# EAGLE board flight_computer_board_2018_04_14 (EAGLE 8.6.0)
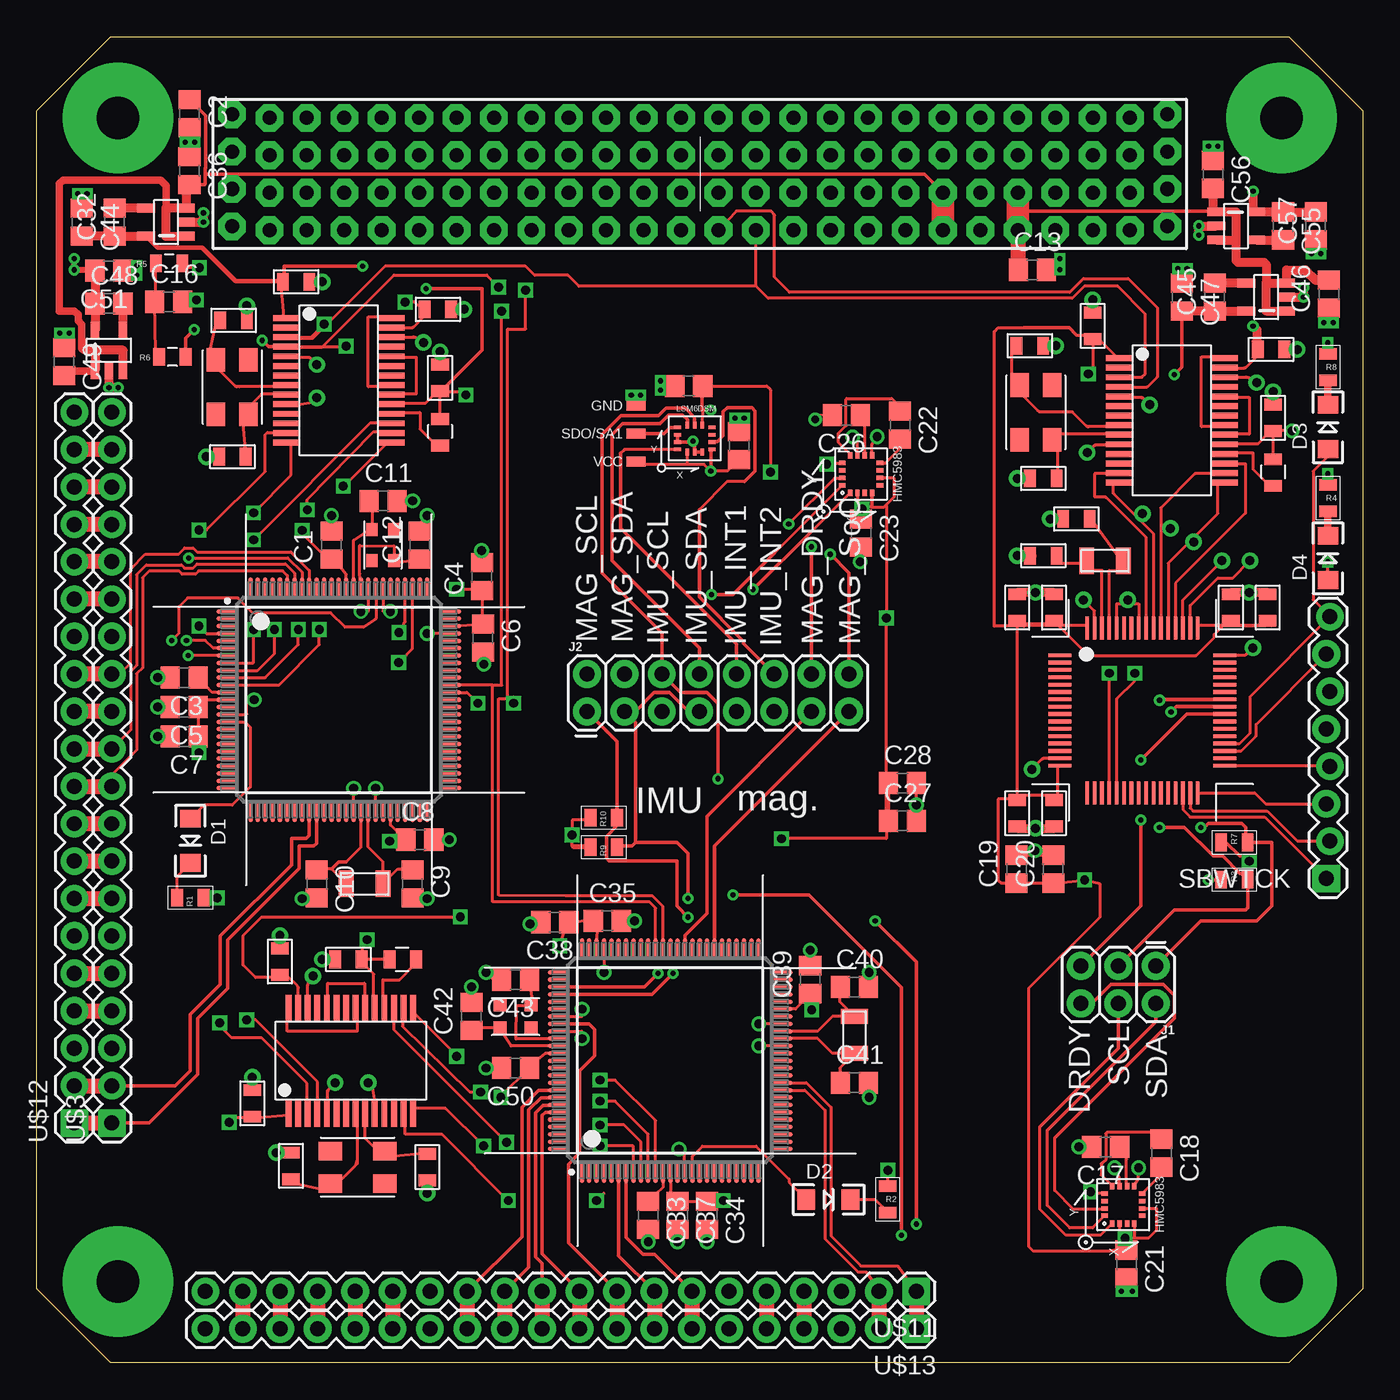
[diagram p5: board, top side]
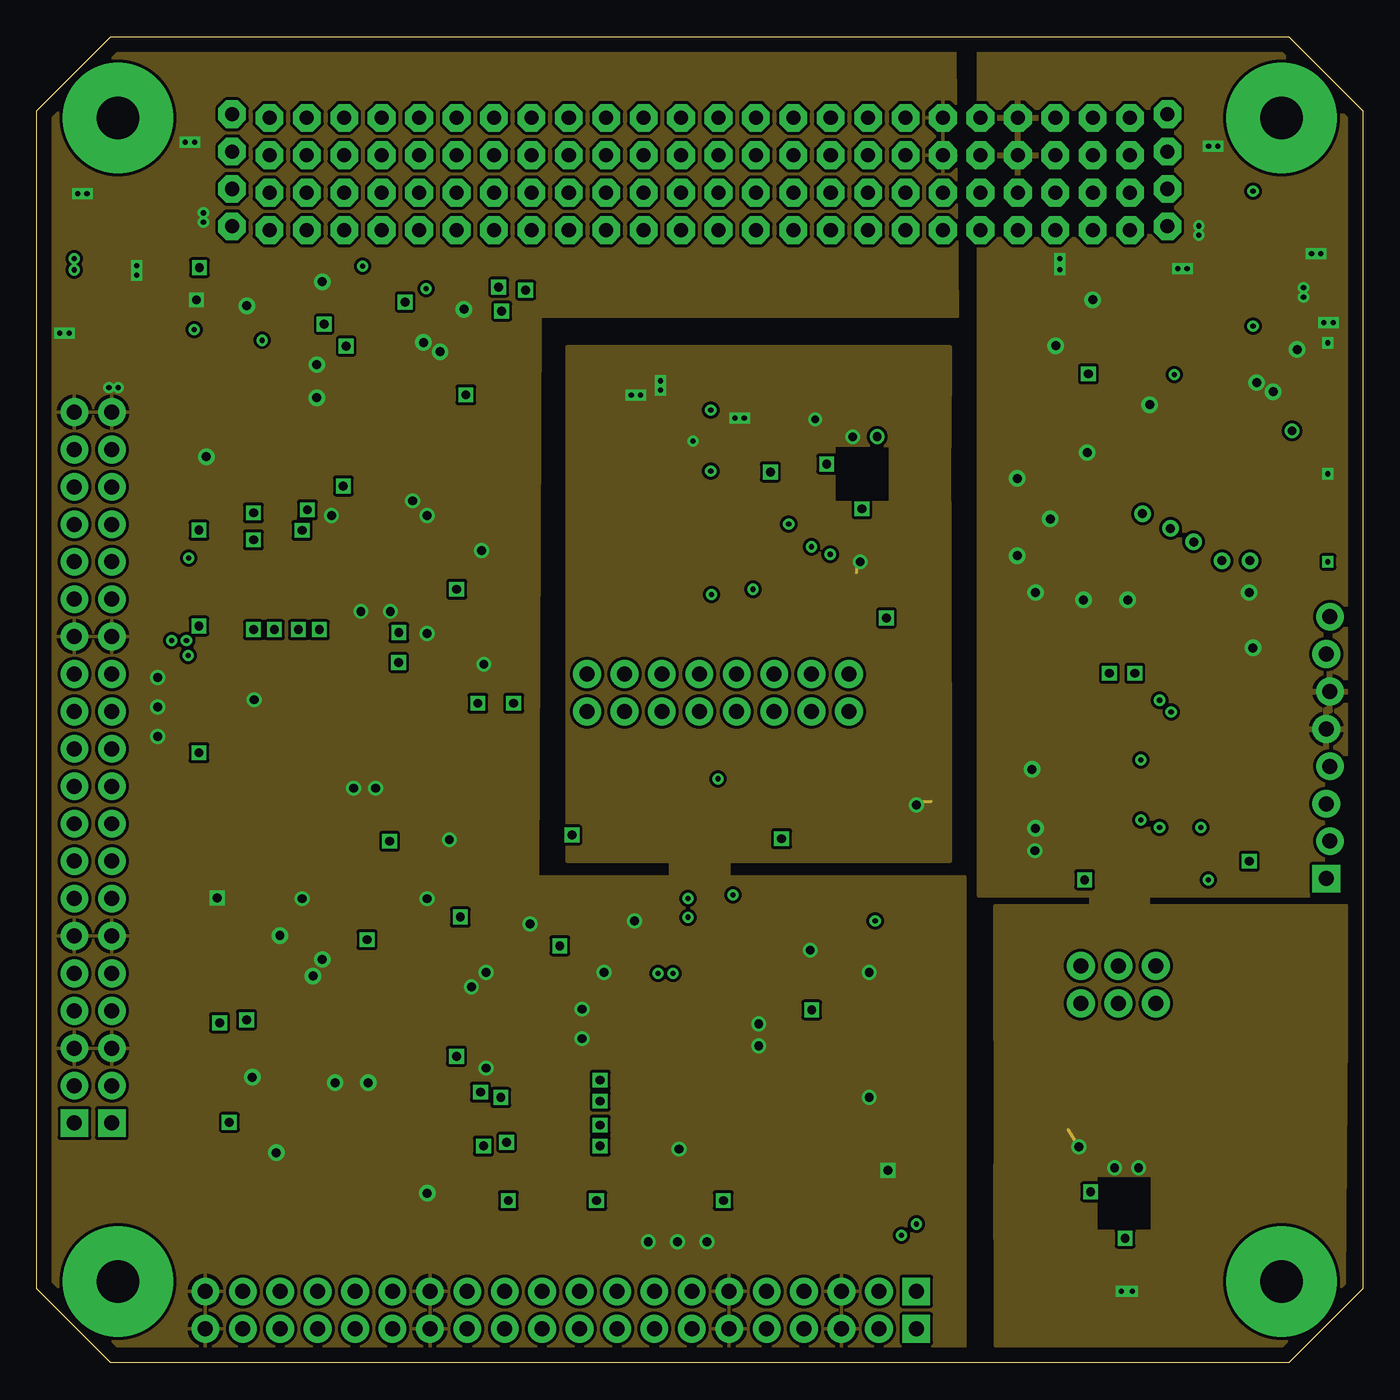
[diagram p6: board, inner layer GND]
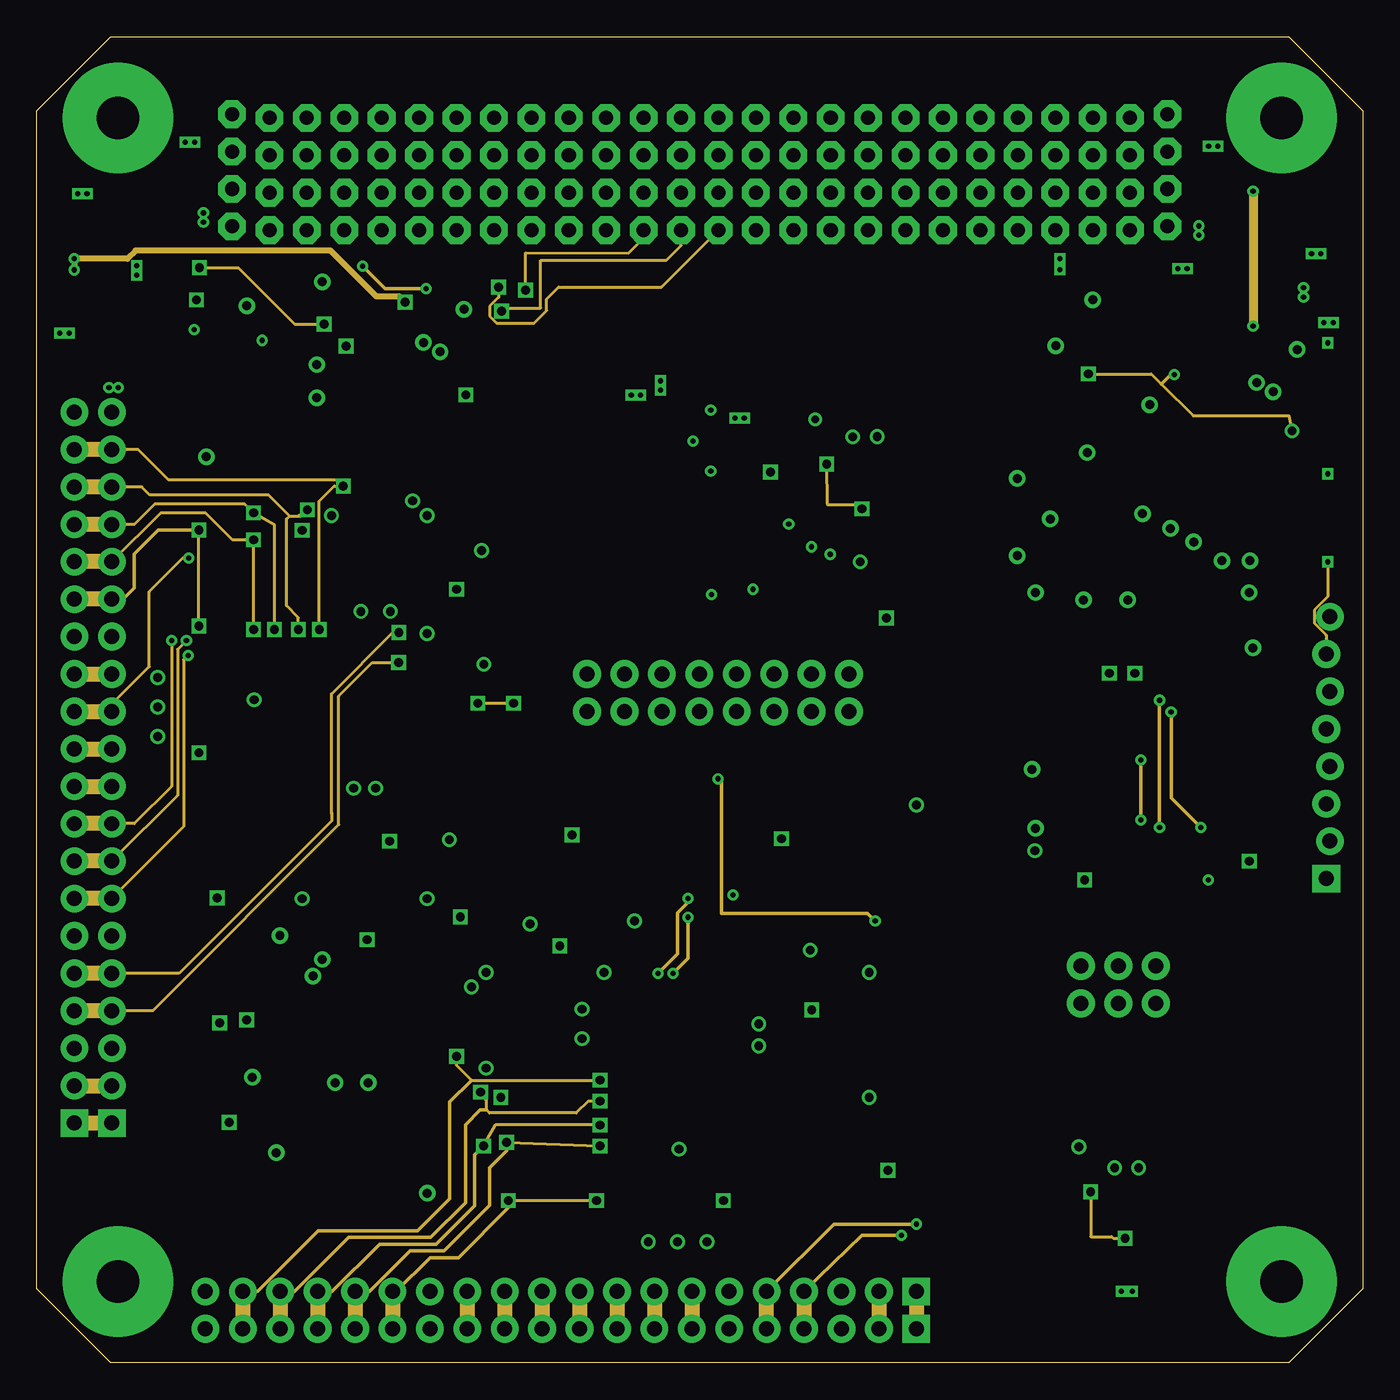
[diagram p7: board, inner layer Route3]
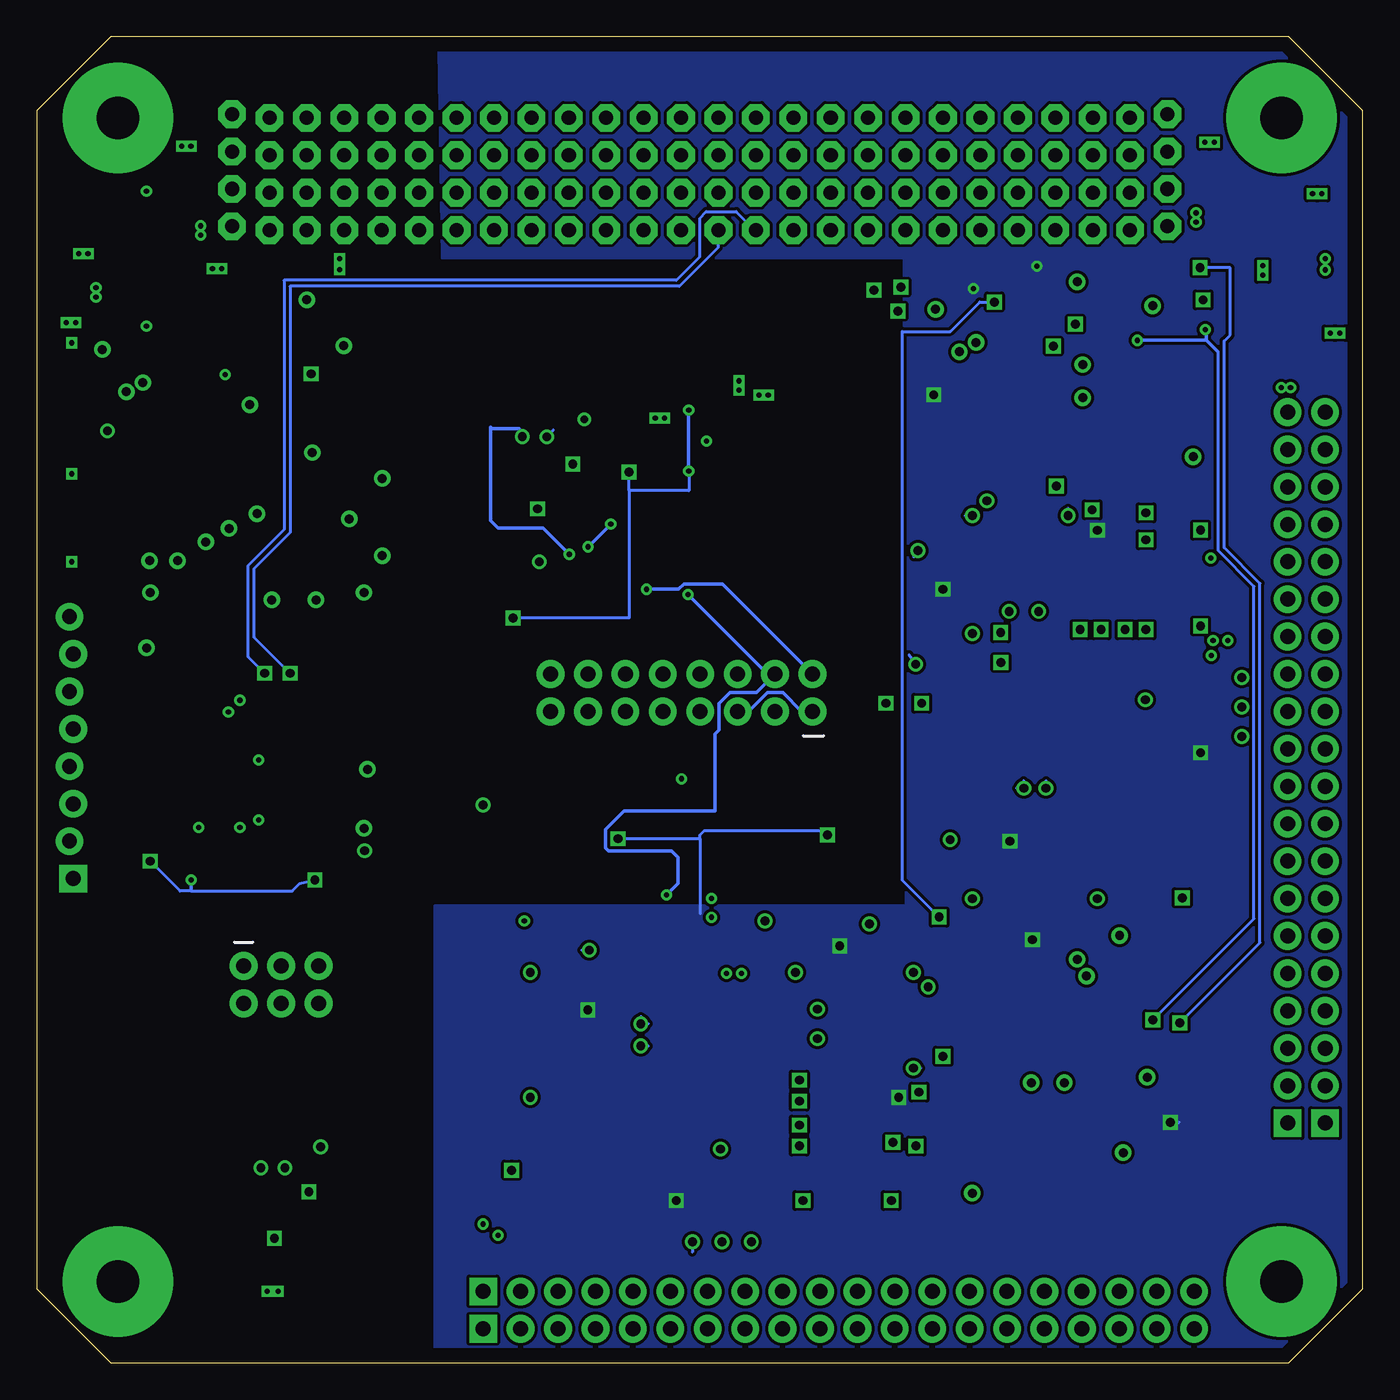
[diagram p8: board, bottom side, seen from below]

Size 90 x 90 mm. Coordinates in mm from the lower left corner, seen from the top.
Copper layers (1*2*3*16): Top 0.035mm / dielectric 1.5mm / GND 0.035mm / dielectric 0.15mm / Route3 0.035mm / dielectric 0.2mm / Bottom 0.035mm
Design rules "default *": minimum track width 10mil, minimum drill 24mil, track to track 8mil, track to pad 8mil, pad to pad 8mil, via to via 8mil, smd to smd 0mil, copper to edge 40mil, drill to drill 8mil, minimum pad ring 10mil, minimum via ring 8mil, stop-mask expansion 4mil, vias tented up to drill 0mil, thermal gap 10mil
Net classes: 0 default: width 0.254 mm, drill 0.254 mm, clearance 0.152 mm

## Footprints (pad centres in the part's own frame; a part is rotated, then mirrored left to right if it is on the bottom)
C0805 = smd 1.3 x 1.5: 1 -0.95,0; 2 0.95,0
LED-1206 = smd 1.2 x 1.4: A -1.5,0; C 1.5,0
2X3 = drill 1.016 pad 1.88: 1 0,0; 2 0,2.54; 3 2.54,0; 4 2.54,2.54; 5 5.08,0; 6 5.08,2.54
2X8 = drill 1.016 pad 1.88: 1 0,0; 2 0,2.54; 3 2.54,0; 4 2.54,2.54; 5 5.08,0; 6 5.08,2.54; 7 7.62,0; 8 7.62,2.54; 9 10.16,0; 10 10.16,2.54; 11 12.7,0; 12 12.7,2.54; 13 15.24,0; 14 15.24,2.54; 15 17.78,0; 16 17.78,2.54
0805 = smd 0.8 x 1.2: 1 -0.9,0; 2 0.9,0
0_OHM_JUMPER = smd 1.3 x 0.7: P$1 0,-1.9; P$2 0,0; P$3 0,1.9
PZ0100A_N = smd 1.45 x 0.3: 1 -7.575,6; 2 -7.575,5.5; 3 -7.575,5; 4 -7.575,4.5; 5 -7.575,4; 6 -7.575,3.5; 7 -7.575,3; 8 -7.575,2.5; 9 -7.575,2; 10 -7.575,1.5; 11 -7.575,1; 12 -7.575,0.5; 13 -7.575,0; 14 -7.575,-0.5; 15 -7.575,-1; 16 -7.575,-1.5; 17 -7.575,-2; 18 -7.575,-2.5; 19 -7.575,-3; 20 -7.575,-3.5; 21 -7.575,-4; 22 -7.575,-4.5; 23 -7.575,-5; 24 -7.575,-5.5; 25 -7.575,-6; 51 7.575,-6; 52 7.575,-5.5; 53 7.575,-5; 54 7.575,-4.5; 55 7.575,-4; 56 7.575,-3.5; 57 7.575,-3; 58 7.575,-2.5; 59 7.575,-2; 60 7.575,-1.5; 61 7.575,-1; 62 7.575,-0.5; 63 7.575,0; 64 7.575,0.5; 65 7.575,1; 66 7.575,1.5; 67 7.575,2; 68 7.575,2.5; 69 7.575,3; 70 7.575,3.5; 71 7.575,4; 72 7.575,4.5; 73 7.575,5; 74 7.575,5.5; 75 7.575,6 | smd 0.3 x 1.45: 26 -6,-7.575; 27 -5.5,-7.575; 28 -5,-7.575; 29 -4.5,-7.575; 30 -4,-7.575; 31 -3.5,-7.575; 32 -3,-7.575; 33 -2.5,-7.575; 34 -2,-7.575; 35 -1.5,-7.575; 36 -1,-7.575; 37 -0.5,-7.575; 38 0,-7.575; 39 0.5,-7.575; 40 1,-7.575; 41 1.5,-7.575; 42 2,-7.575; 43 2.5,-7.575; 44 3,-7.575; 45 3.5,-7.575; 46 4,-7.575; 47 4.5,-7.575; 48 5,-7.575; 49 5.5,-7.575; 50 6,-7.575; 76 6,7.575; 77 5.5,7.575; 78 5,7.575; 79 4.5,7.575; 80 4,7.575; 81 3.5,7.575; 82 3,7.575; 83 2.5,7.575; 84 2,7.575; 85 1.5,7.575; 86 1,7.575; 87 0.5,7.575; 88 0,7.575; 89 -0.5,7.575; 90 -1,7.575; 91 -1.5,7.575; 92 -2,7.575; 93 -2.5,7.575; 94 -3,7.575; 95 -3.5,7.575; 96 -4,7.575; 97 -4.5,7.575; 98 -5,7.575; 99 -5.5,7.575; 100 -6,7.575
SOT-23-5 = smd 0.6 x 1.2: P$1 -0.95,-1.35; P$2 0,-1.35; P$3 0.95,-1.35; P$4 0.95,1.35; P$5 -0.95,1.35
FC-135R = smd 1 x 1.8: P$1 -1.25,0; P$2 1.25,0
FA-238 = smd 0.9 x 0.8: P$1 -1.05,-0.75; P$2 1.05,-0.75; P$3 1.05,0.75; P$4 -1.05,0.75
1X20 = drill 1.016 pad 1.88 square: 1 0,0 | drill 1.016 pad 1.88: 2 2.54,0; 3 5.08,0; 4 7.62,0; 5 10.16,0; 6 12.7,0; 7 15.24,0; 8 17.78,0; 9 20.32,0; 10 22.86,0; 11 25.4,0; 12 27.94,0; 13 30.48,0; 14 33.02,0; 15 35.56,0; 16 38.1,0; 17 40.64,0; 18 43.18,0; 19 45.72,0; 20 48.26,0
BOARD_TEMPLATE = drill 2.9 pad 7.5: P$1 -39.5,39.5; P$2 -39.5,-39.5; P$3 39.5,-39.5; P$4 39.5,39.5
PC104_CONNECTOR = drill 0.953 pad 1.88 octagon: P$1 -31.75,32.134; P$2 -31.75,34.674; P$3 -31.75,37.214; P$4 -31.75,39.754; P$5 -29.21,31.88; P$6 -29.21,34.42; P$7 -29.21,36.96; P$8 -29.21,39.5; P$9 -26.67,31.88; P$10 -26.67,34.42; P$11 -26.67,36.96; P$12 -26.67,39.5; P$13 -24.13,31.88; P$14 -24.13,34.42; P$15 -24.13,36.96; P$16 -24.13,39.5; P$17 -21.59,31.88; P$18 -21.59,34.42; P$19 -21.59,36.96; P$20 -21.59,39.5; P$21 -19.05,31.88; P$22 -19.05,34.42; P$23 -19.05,36.96; P$24 -19.05,39.5; P$25 -16.51,31.88; P$26 -16.51,34.42; P$27 -16.51,36.96; P$28 -16.51,39.5; P$29 -13.97,31.88; P$30 -13.97,34.42; P$31 -13.97,36.96; P$32 -13.97,39.5; P$33 -11.43,31.88; P$34 -11.43,34.42; P$35 -11.43,36.96; P$36 -11.43,39.5; P$37 -8.89,31.88; P$38 -8.89,34.42; P$39 -8.89,36.96; P$40 -8.89,39.5; P$41 -6.35,31.88; P$42 -6.35,34.42; P$43 -6.35,36.96; P$44 -6.35,39.5; P$45 -3.81,31.88; P$46 -3.81,34.42; P$47 -3.81,36.96; P$48 -3.81,39.5; P$49 -1.27,31.88; P$50 -1.27,34.42; P$51 -1.27,36.96; P$52 -1.27,39.5; P$53 1.27,31.88; P$54 1.27,34.42; P$55 1.27,36.96; P$56 1.27,39.5; P$57 3.81,31.88; P$58 3.81,34.42; P$59 3.81,36.96; P$60 3.81,39.5; P$61 6.35,31.88; P$62 6.35,34.42; P$63 6.35,36.96; P$64 6.35,39.5; P$65 8.89,31.88; P$66 8.89,34.42; P$67 8.89,36.96; P$68 8.89,39.5; P$69 11.43,31.88; P$70 11.43,34.42; P$71 11.43,36.96; P$72 11.43,39.5; P$73 13.97,31.88; P$74 13.97,34.42; P$75 13.97,36.96; P$76 13.97,39.5; P$77 16.51,31.88; P$78 16.51,34.42; P$79 16.51,36.96; P$80 16.51,39.5; P$81 19.05,31.88; P$82 19.05,34.42; P$83 19.05,36.96; P$84 19.05,39.5; P$85 21.59,31.88; P$86 21.59,34.42; P$87 21.59,36.96; P$88 21.59,39.5; P$89 24.13,31.88; P$90 24.13,34.42; P$91 24.13,36.96; P$92 24.13,39.5; P$93 26.67,31.88; P$94 26.67,34.42; P$95 26.67,36.96; P$96 26.67,39.5; P$97 29.21,31.88; P$98 29.21,34.42; P$99 29.21,36.96; P$100 29.21,39.5; P$101 31.75,32.134; P$102 31.75,34.674; P$103 31.75,37.214; P$104 31.75,39.754
MSP-CAN_BLOCK = smd 1.2 x 0.8: 1 -6,6.08; 2 -6,7.88; 3 -8.5,6.08; 4 -8.5,7.88; 9 -8.5,-6.08; 10 -8.5,-7.88; 11 -6,-6.08; 12 -6,-7.88; 13 8.5,6.08; 14 8.5,7.88; 15 6,6.08; 16 6,7.88; 23 8.875,18.955; 24 8.875,20.755; 25 8.875,17.045; 26 8.875,15.245; 27 -3.375,25.205; 28 -3.375,27.005 | smd 1 x 0.25: 3.3V@CAN1 -3.375,25.125; 3.3V@CAN2 8.875,18.875; 3.3V@MSP1 8.501,5.884; 3.3V@MSP2 -8.533,-5.962; 3.3V_ANALOG@MSP2 -8.482,5.904 | smd 0.8 x 1.2: 5 -5.83,10.5; 6 -7.63,10.5; 7 -3.58,13; 8 -5.38,13; 17 -8.545,24.75; 18 -6.745,24.75; 19 -5.83,15.75; 20 -7.63,15.75; 21 7.83,24.5; 22 9.63,24.5 | smd 0.25 x 1: 5V 7.65,24.5 | smd 1.75 x 0.4: CANH -1.6,21.96; CANL -1.6,22.61; P$65 -1.6,23.91; P$66 -1.6,23.26; P$69 -1.6,21.31; P$70 -1.6,20.66; P$71 -1.6,20.01; P$72 -1.6,19.36; P$73 -1.6,18.71; P$74 -1.6,18.06; P$75 -1.6,17.41; P$76 -1.6,16.76; P$77 -1.6,16.11; P$78 -1.6,15.46; P$79 5.6,15.46; P$80 5.6,16.11; P$81 5.6,16.76; P$82 5.6,17.41; P$83 5.6,18.06; P$84 5.6,18.71; P$85 5.6,19.36; P$86 5.6,20.01; P$87 5.6,20.66; P$88 5.6,21.31; P$89 5.6,21.96; P$90 5.6,22.61; P$91 5.6,23.26; P$92 5.6,23.91 | drill 0.61: GND@1 -3.375,27.875; GND@2 -5.875,24.75; GND@3 -3.75,17.5; GND@4 0.5,20.75; GND@5 -8.5,15.75; GND@7 -8.5,10.5; GND@8 -7.25,8; GND@9 -4,7.5; GND@10 -1,7.5; GND@11 7.75,22.25; GND@12 10.5,24.5; GND@13 8.875,21.625; GND@14 7.25,8; GND@15 7.5,4.25; GND@16 -7.5,-4; GND@17 -7.25,-8; GND@26 -6.25,13; P2.4_SPI-CS2 5.397,10.16; P2.7_SPI-CS3 7.303,10.16; P5.4_SPI-MOSI 3.487,11.434; P5.5_SPI-MISO 1.9,12.354; P5.6_SPI-CLK 0,13.348 | smd 1.55 x 0.25: P1.0_A0 -5.6,3.75; P1.1_A1 -5.6,3.25; P1.2_A2 -5.6,2.75; P1.3_A3 -5.6,-1.75; P1.4_A4 -5.6,-2.25; P1.5_A5 -5.6,-2.75; P1.6_GPIO/PWM 5.6,-0.75; P1.7_GPIO/PWM 5.6,-0.25; P2.1_RXD 5.6,-3.75; P2.2_GPIO/PWM 5.6,-3.25; P3.0_A12 -5.6,2.25; P3.1_A13 -5.6,1.75; P3.2_A14 -5.6,1.25; P3.3_A15 -5.6,0.75; P3.4_GPIO_DEBUG 5.6,-2.75; P3.5_GPIO_DEBUG 5.6,-2.25; P3.6_GPIO/PWM 5.6,-1.75; P3.7_GPIO/PWM 5.6,-1.25; P5.0_I2C-SDA-1 5.6,0.25; P5.1_I2C-SCL-1 5.6,0.75; P7.0_I2C-SDA-2 -5.6,-0.25; P7.1_I2C-SCL-2 -5.6,-0.75; P$8 -5.6,0.25; P$11 -5.6,-1.25; P$15 -5.6,-3.25; P$16 -5.6,-3.75; P$43 5.6,1.25; P$44 5.6,1.75; P$45 5.6,2.25; P$46 5.6,2.75; P$47 5.6,3.25; P$48 5.6,3.75 | smd 0.25 x 1.55: P2.0_TXD 3.75,-5.6; P2.5_GPIO 1.75,-5.6; P2.6_GPIO/PWM 2.25,-5.6; P4.0_GPIO -0.25,-5.6; P4.1_GPIO 0.25,-5.6; P4.2_GPIO 0.75,-5.6; P4.3_GPIO 1.25,-5.6; P7.2_SYNC1 -1.75,-5.6; P7.3_GPIO -1.25,-5.6; P7.4_GPIO -0.75,-5.6; P$17 -3.75,-5.6; P$18 -3.25,-5.6; P$19 -2.75,-5.6; P$49 3.75,5.6; P$50 3.25,5.6; P$51 2.75,5.6; P$52 2.25,5.6; P$53 1.75,5.6; P$54 1.25,5.6; P$55 0.75,5.6; P$56 0.25,5.6; P$57 -0.25,5.6; P$58 -0.75,5.6; P$59 -1.25,5.6; P$60 -1.75,5.6; P$61 -2.25,5.6; P$62 -2.75,5.6; P$63 -3.25,5.6; P$64 -3.75,5.6; PJ.3_SYNC2 -2.25,-5.6; SBWTCK 2.75,-5.6; SBWTDIO 3.25,-5.6 | smd 1 x 1.8: P$93 -3.79,10.16; P$94 -1.29,10.16 | smd 1.25 x 1.6: P$104 -6.13,18.38; P$105 -6.13,22.08; P$106 -8.33,22.08; P$107 -8.33,18.38
CAN_BLOCK = smd 0.25 x 1: 3.3V@CAN1 -3.875,6.375; 5V 5.65,4.5 | smd 1 x 0.25: 3.3V@CAN2 6.875,-1.125; CLK -3.25,-4.6; CS 3.4,-3.2; INT -3.25,-3.85; MISO 3.25,-4.6; MOSI 3.25,-3.85 | smd 0.8 x 1.2: 17 -8.045,3.75; 18 -6.245,3.75; 19 -6.33,-5.5; 20 -8.13,-5.5; 21 5.83,4.5; 22 7.63,4.5; 27 -3.795,6.375; 28 -1.995,6.375 | smd 1.2 x 0.8: 23 6.875,-1.045; 24 6.875,0.755; 25 6.875,-2.955; 26 6.875,-4.755 | smd 1.75 x 0.4: CANH -3.6,1.96; CANL -3.6,2.61; P$65 -3.6,3.91; P$66 -3.6,3.26; P$69 -3.6,1.31; P$70 -3.6,0.66; P$71 -3.6,0.01; P$72 -3.6,-0.64; P$73 -3.6,-1.29; P$74 -3.6,-1.94; P$75 -3.6,-2.59; P$76 -3.6,-3.24; P$77 -3.6,-3.89; P$78 -3.6,-4.54; P$79 3.6,-4.54; P$80 3.6,-3.89; P$81 3.6,-3.24; P$82 3.6,-2.59; P$83 3.6,-1.94; P$84 3.6,-1.29; P$85 3.6,-0.64; P$86 3.6,0.01; P$87 3.6,0.66; P$88 3.6,1.31; P$89 3.6,1.96; P$90 3.6,2.61; P$91 3.6,3.26; P$92 3.6,3.91 | drill 0.61: GND@1 -1.125,6.375; GND@2 -6.25,4.75; GND@3 -1.5,-1.5; GND@4 -1.5,0.75; GND@5 -9,-5.5; GND@11 5.75,2.25; GND@12 8.5,4.5; GND@13 6.875,1.625 | smd 1.25 x 1.6: P$104 -6.13,-2.62; P$105 -6.13,1.08; P$106 -8.33,1.08; P$107 -8.33,-2.62
1X08_CONNECTOR = drill 1.016 pad 1.88: 2 2.54,-0.127; 3 5.08,0.127; 4 7.62,-0.127; 5 10.16,0.127; 6 12.7,-0.127; 7 15.24,0.127; 8 17.78,-0.127 | drill 1.016 pad 1.88 square: SBWTCK 0,0.127
HMC5983 = smd 0.45 x 0.3: !SPI_CS -1.275,-0.75; C1 1.275,-0.25; GND 1.275,0.25; NC@3 -1.275,-0.25; SCL/SPI_SCK -1.275,0.75; SETC 1.275,0.75; SOC 1.275,-0.75; VDD -1.275,0.25 | smd 0.3 x 0.45: DRDY -0.25,1.275; I2C/!SPI -0.25,-1.275; NC@1 0.25,1.275; NC@2 0.25,-1.275; SDA/SPI_SDI -0.75,1.275; SETP 0.75,-1.275; SPI_SDO -0.75,-1.275; VDDIO 0.75,1.275
LSM6DSM = smd 0.25 x 0.475: CS 0.5,0.912; GND@1 0,-0.912; GND@2 0.5,-0.912; SCL 0,0.912; SDA -0.5,0.912; VDDIO -0.5,-0.912 | smd 0.475 x 0.25: INT1 -1.163,-0.75; INT2 1.163,-0.25; OCS_AUX 1.163,0.25; SCX -1.163,-0.25; SDO/SA0 -1.163,0.75; SDO_AUX 1.163,0.75; SDX -1.163,0.25; VDD 1.163,-0.75

## Placement (x,y rotation side)
C1  0.1uF  [C0805]  20,55.5 90 top
C2  10 uF  [C0805]  10.37,84.77 270 top
C3  0.1 uF  [C0805]  10,46.5 180 top
C4  4.7 uF  [C0805]  30.21,53.35 90 top
C5  0.1 uF  [C0805]  10,44.5 180 top
C6  0.1 uF  [C0805]  30.29,49.18 270 top
C7  4.7 uF  [C0805]  10,42.5 180 top
C8  0.1 uF  [C0805]  26,35.5 0 top
C9  13 pF  [C0805]  25.5,32.5 270 top
C10  13 pF  [C0805]  19,32.5 270 top
C11  13 pF  [C0805]  23.5,58.5 0 top
C12  13 pF  [C0805]  26,55.5 90 top
C13  10 uF  [C0805]  67.57,74.18 0 top
C16  4.7 nF  [C0805]  8.96,72.01 0 top
C17  4.7 uF  [C0805]  72.55,14.64 180 top
C18  0.22 uF  [C0805]  76.34,14.23 270 top
C19  0.1 uF  [C0805]  66.5,33.5 90 top
C20  0.1 uF  [C0805]  69,33.5 90 top
C21  0.1 uF  [C0805]  73.97,6.7 270 top
C22  0.22 uF  [C0805]  58.59,63.65 270 top
C23  0.1 uF  [C0805]  55.95,56.32 270 top
C24  0.1 uF  [C0805]  44.25,66.3 180 top
C25  0.1 uF  [C0805]  47.67,62.26 270 top
C26  4.7 uF  [C0805]  54.95,64.32 180 top
C27  0.1 uF  [C0805]  58.76,36.78 0 top
C28  0.1 uF  [C0805]  58.76,39.35 0 top
C32  0.01 μF  [C0805]  5.28,77.42 90 top
C33  0.1 uF  [C0805]  41.5,10 270 top
C34  4.7 uF  [C0805]  45.5,10 270 top
C35  0.1 uF  [C0805]  38.72,29.99 0 top
C36  1 μF  [C0805]  10.36,80.91 270 top
C37  0.1 uF  [C0805]  43.5,10 270 top
C38  4.7 uF  [C0805]  35.16,29.9 180 top
C39  0.1 uF  [C0805]  52.5,26 90 top
C40  13 pF  [C0805]  55.5,25.5 0 top
C41  13 pF  [C0805]  55.5,19 0 top
C42  13 pF  [C0805]  29.5,23.5 90 top
C43  13 pF  [C0805]  32.5,26 180 top
C44  4.7 μF  [C0805]  3.06,77.42 270 top
C45  0.01 μF  [C0805]  79.96,72.34 90 top
C46  1 μF  [C0805]  87.7,72.53 90 top
C47  4.7 μF  [C0805]  77.73,72.34 270 top
C48  0.01 μF  [C0805]  4.9,71.89 0 top
C49  1 μF  [C0805]  1.85,67.95 270 top
C50  0.1 uF  [C0805]  32.5,20 180 top
C51  4.7 μF  [C0805]  4.9,74.11 180 top
C55  0.01 μF  [C0805]  84.59,77.16 270 top
C56  1 μF  [C0805]  79.83,80.66 270 top
C57  4.7 μF  [C0805]  86.81,77.16 90 top
D1  [LED-1206]  10.42,35.42 270 top
D2  [LED-1206]  53.73,11.07 0 top
D3  [LED-1206]  87.64,63.51 90 top
D4  [LED-1206]  87.64,54.62 90 top
J1  FEMALE 2x3  [2X3]  75.96,26.93 180 top
J2  [2X8]  37.35,44.21 0 top
R1  330 ohm  [0805]  10.42,31.56 0 top
R2  330 ohm  [0805]  57.76,11.09 90 top
R3  10 kohm  [0805]  81.29,32.78 180 top
R4  [0805]  87.64,58.68 90 top
R5  60  [0805]  8.98,74.63 180 top
R6  60  [0805]  9.2,68.28 180 top
R7  10 kohm  [0805]  81.29,35.32 180 top
R8  [0805]  87.64,67.57 90 top
R9  10 kohm  [0805]  38.49,34.98 0 top
R10  10 kohm  [0805]  38.49,36.98 0 top
SDO/SA1  0_OHM_JUMPER  [0_OHM_JUMPER]  40.67,63.06 180 top
U1  Value  [PZ0100A_N]  20.5,45 0 top
U2  Value  [PZ0100A_N]  43,20.5 90 top
U4  TPS732XX  [SOT-23-5]  8.77,77.42 90 top
U5  TPS732XX  [SOT-23-5]  83.45,72.34 90 top
U6  TPS732XX  [SOT-23-5]  4.9,68.72 0 top
U8  TPS732XX  [SOT-23-5]  81.42,77.16 270 top
U$1  EPSON_CRYSTAL_FC-135R  [FC-135R]  22.25,32.5 180 top
U$2  EPSON_CRYSTAL_FA-238  [FA-238]  23.5,55.5 270 top
U$3  M20  [1X20]  5.09,16.27 90 top
U$4  EPSON_CRYSTAL_FC-135R  [FC-135R]  55.5,22.25 270 top
U$5  BOARD_TEMPLATE1  [BOARD_TEMPLATE]  45,45 0 top
U$6  PC104_CONNECTOR  [PC104_CONNECTOR]  45,45 0 top
U$7  MSP-CAN_BLOCK  [MSP-CAN_BLOCK]  75.05,44.28 0 top
U$8  CAN_BLOCK  [CAN_BLOCK]  20.5,67 0 top
U$9  EPSON_CRYSTAL_FA-238  [FA-238]  32.5,23.5 0 top
U$10  CAN_BLOCK  [CAN_BLOCK]  21,20.5 90 top
U$11  M20  [1X20]  59.7,4.84 180 top
U$12  M20  [1X20]  2.55,16.27 90 top
U$13  M20  [1X20]  59.7,2.3 180 top
U$14  PROGRAM/DEBUG_PORT  [1X08_CONNECTOR]  87.66,32.86 90 top
U$15  HMC5983  [HMC5983]  73.75,10.72 90 top
U$17  LSM6DSM  [LSM6DSM]  44.66,62.74 0 top
U$18  HMC5983  [HMC5983]  55.95,60.32 90 top

## Tracks (layer width: path | path; a pad name or v marks a point on that pad's centre or on a via)
BCLUART_RXD1  (via drill 0.35)
  Top 0.203: U1.6 11.97,48.5 11.44,49.03 10.17,49.03 v10.16,49.02
  Top 1.016: U$12.8 U$3.8
  Route3 0.203: v10.16,49.02 9.56,48.42 9.56,38.52 U$3.8
  Route3 1.016: U$3.8 U$12.8
BCLUART_RXD2
  Top 0.254: U2.6 39.5,7.26 U$11.8
  Top 1.016: U$11.8 U$13.8
  Route3 1.016: U$11.8 U$13.8
BCLUART_TXD1  (via drill 0.35)
  Top 0.203: U1.7 v10.27,48
  Top 1.016: U$12.7 U$3.7
  Route3 0.203: v10.27,48 9.97,47.7 9.97,36.38 U$3.7
  Route3 1.016: U$3.7 U$12.7
BCLUART_TXD2
  Top 0.254: U$11.7 41.93,7.37 41.16,7.37 40,8.52 U2.7
  Top 0.406: U$13.7 44.82,2.06
  Top 1.016: U$11.7 U$13.7
  Route3 1.016: U$11.7 U$13.7
BDOT_3V3  (via drill 0.35, 0.6)
  Top 0.203: 70.57,69.76 71.32,69.76 U$7.3.3V@CAN1 71.67,67.41 v71.38,67.12 | v85.2,63.26 84.03,63.26 U$7.3.3V@CAN2 | U$7.3.3V@MSP1 83.44,50.05 80.53,50.05 79.92,49.44 79.92,49.23 78.7,48.02 71.38,48.02 69.22,50.18 U$7.3.3V_ANALOG@MSP2 66.57,38.37 U$7.3.3V@MSP2 66.45,38.25 65.25,38.25 65.25,32.75 65.45,32.55 C19.1 C20.1 | 67,50 65,50 65,70 65.25,70.25 67,70.25 | U$15.VDD 73.57,9.38 73.47,9.27 73.47,8.95 73.87,8.54 v73.87,8.44 | v71.54,11.59 71.94,11.49 72.45,11.49 U$15.VDDIO | v73.87,8.44 73.97,8.14 C21.1 72.87,7.6 | 73.76,7.72 72.87,7.6 | U$15.I2C/!SPI 76,10.47 76,8.97 75.47,8.44 74.5,8.44 | 74.5,8.44 v73.87,8.44 | U$15.!SPI_CS 74.5,8.44 | 72.87,7.6 67.61,7.6 67.32,7.88 67.32,25.41 72.15,30.24 72.15,32.52 v71.13,32.78 69.08,32.52 69.03,32.52 C20.1 | 69.15,32.75 C20.1
  Top 0.254: v82.31,34.05 81.97,34.39 81.65,34.39 80.72,35.32 R7.2 | C47.2 77.73,67.57 v77.23,67.07 | 67,70.25 70.08,70.25 70.57,69.76 | U$7.3.3V_ANALOG@MSP2 66.82,50.18 67,50 | R3.2 v79.51,32.78
  Top 0.61: U5.P$5 C45.1 C47.2
  Route3 0.203: v71.38,67.12 75.65,67.12 76.34,66.43 78.5,64.27 85,64.27 v85.2,63.26 | v71.54,11.59 71.54,8.54 72.96,8.54 73.06,8.44 v73.87,8.44
  Route3 0.254: v77.23,67.07 76.97,67.07 76.34,66.43
  Bottom 0.203: v82.31,34.05 80.27,32.01 79.51,32.01 72.65,32.01 72.15,32.52 v71.13,32.78
  Bottom 0.254: v79.51,32.78 79.51,32.01
BDOT_5V  (via drill 0.35)
  Top 0.254: 82.81,69.35 82.81,68.89 U$7.5V
  Top 0.61: C57.2 C55.1 U8.P$5 82.56,78.32 v82.56,79.51 | v82.56,70.37 82.81,70.11 82.81,69.35
  Route3 0.61: v82.56,79.51 v82.56,70.37
BDOT_DRDY
  Top 0.203: U$15.DRDY arc-90 72.42,10.42 70.37,10.42 69.1,11.69 69.1,15.25
  Top 0.254: J1.6 71.62,24.39 72.89,25.66 76.48,25.66 77.23,24.92 77.23,23.38 69.1,15.25
BDOT_DRDY_JP  (via drill 0.35)
  Top 0.254: J1.5 74.94,31 v74.94,36.84 | v74.94,40.9 78.06,44.03 U$7.P1.7_GPIO/PWM
  Route3 0.254: v74.94,36.84 v74.94,40.9
BDOT_GND  (via drill 0.35, 0.6)
  Top 0.203: C19.2 C20.2 69,34.5 v67.75,34.75 | U$15.GND 73.47,12.03 73.47,12.61 73.16,12.91 v73.16,13.22 | U$15.SOC 74.79,12.49 v74.79,13.22 | C17.2 v70.72,14.64 | C13.2 68.55,74.2 v69.45,74.2 v69.45,74.94
  Top 0.254: v74.36,4.84 74.36,5.36 74.02,5.7 | 74.02,5.7 C21.2 | v73.62,4.84 74.02,5.24 74.02,5.7
  Top 0.305: v78.08,74.27 77.95,73.5 77.89,73.45 | 77.89,73.45 C47.1 | v77.44,74.27 77.89,73.69 77.89,73.45 | v87.36,70.59 87.48,71.36 C46.1 88.12,71.16 v87.99,70.59
  Top 0.508: R4.2 v87.64,60.34 | R8.2 v87.64,69.22
  Top 0.61: U5.P$2 v85.99,72.34 v85.99,72.97 | U8.P$2 v78.88,77.16 v78.88,76.53 | v86.53,75.28 86.81,75.57 C57.1 86.81,75.63 v87.16,75.28 | v79.54,82.59 79.54,81.9 C56.1 79.83,82.24 v80.17,82.59
  GND 0.203: 68,34.75 v67.75,34.75 | v74.79,13.22 74.89,13.62 | v73.16,13.22 73.36,13.22 | v70.72,14.64 70.01,15.81
  pour GND: 64,90 90,90 90,31.75 64,31.75
  pour GND (rank 2): 65.03,1.16 88.75,1.16 89,31 75.5,31 75.5,34 71.5,34 71.5,31 65,31 65.03,12.71 75.7,12.71 75.7,8.9 65.03,8.9
  pour GND (no thermals): 65.03,13.47 71.89,13.47 71.89,8.39 65.03,8.39
BDOT_LDO_3V3_BYP
  Top 0.61: U5.P$4 C45.2
BDOT_LDO_5V_BYP
  Top 0.61: U8.P$4 C55.2
BDOT_P3.4_GPIO_DEBUG  (via drill 0.35)
  Top 0.203: U$7.P3.4_GPIO_DEBUG 81.76,41.53 82.74,42.5 | 82.74,42.5 82.76,42.53 | 82.74,42.5 82.74,42.54 82.76,42.56 82.76,43.34 U$14.7 | D4.A v87.64,54.37
  Route3 0.203: v87.64,54.37 87.64,52.01 86.72,51.08 86.72,50.2 87.53,49.39 U$14.7
BDOT_P3.5_GPIO_DEBUG
  Top 0.203: U$7.P3.5_GPIO_DEBUG 81.65,42.03 82.36,42.73 82.36,45.22 U$14.8 86.63,51.79 86.63,60.52 87.64,61.52 D3.A
BDOT_RXD
  Top 0.203: U$14.4 87.74,40.53 U$7.P2.1_RXD
BDOT_SCL
  Top 0.203: 72.96,9.41 U$15.SCL/SPI_SCK 72.19,8.65 69.86,8.65 68.08,10.42 68.08,16.01
  Top 0.254: 68.08,16.01 73.42,21.35 J1.4
BDOT_SCL_JP  (via drill 0.35)
  Top 0.254: J1.3 77.23,30.74 82.05,30.74 82.17,30.86 82.19,30.86 R3.1 81.75,33.21 81.67,33.21 80.49,34.39 79.85,34.39 77.91,36.33 v76.21,36.33 | v76.21,44.97 76.27,45.03 U$7.P5.1_I2C-SCL-1
  Route3 0.254: v76.21,36.33 v76.21,44.97
BDOT_SDA
  Top 0.203: 71.72,9.22 U$15.SDA/SPI_SDI 71.65,9.15 70.11,9.15 68.59,10.68 68.59,15.76
  Top 0.254: 68.59,15.76 75.96,23.12 J1.2
BDOT_SDA_JP  (via drill 0.35)
  Top 0.254: J1.1 79,29.98 82.81,29.98 83.83,31 83.83,35.32 R7.1 82.05,35.45 82.05,36.33 81.8,36.59 79.51,36.59 79.26,36.33 v79,36.33 | v77,44.18 77.35,44.53 U$7.P5.0_I2C-SDA-1
  Route3 0.254: v79,36.33 77,38.34 v77,44.18
BDOT_TXD
  Top 0.203: U$7.P2.0_TXD 82.68,38.68 83.41,37.94 U$14.3
BDOT_VBAT
  Top 0.254: U5.P$3 | C46.2 87.94,73.72 | U8.P$1 80.03,78.15 67.16,78.15 67.07,78.24 66.59,78.24 | U$6.P$86 67.33,79.42
  Top 0.508: U5.P$1 | 79.83,80.02 C56.2
  Top 0.61: 83.45,73.29 U5.P$3 | 83.45,73.29 83.45,71.38 U5.P$1 | U8.P$1 81.42,78.11 81.42,76.21 | 81.42,76.21 81.41,76.21 U8.P$3 | U8.P$1 79.83,78.35 79.83,80.02 | U5.P$3 84.85,73.33 84.85,74.18 86.12,74.18 86.82,73.48 C46.2 | 83.45,73.29 83.45,74.56 83.32,74.69 81.54,74.69 81.42,74.81 81.42,76.21
  Top 1.016: C13.1 66.62,76.85 U$6.P$85
  Top 1.524: U$6.P$86 66.59,78.24 U$6.P$85
CAN-INT1  (via drill 0.6)
  Top 0.203: v11,50 11.5,49.5 U1.4 | v11,56.51 11.51,56.51 15.5,60.5 15.5,63 15.65,63.15 U$8.INT
  Top 1.016: U$3.15 U$12.15
  Route3 0.203: v11,50 v11,56.51
  Route3 0.254: v11,56.51 8.25,56.51 6.61,54.87 6.61,52.59 5.85,51.83 U$3.15
  Route3 1.016: U$3.15 U$12.15
CAN-INT2  (via drill 0.6)
  Top 0.203: 38.5,11.5 v38,11 | v32,11 27.5,15.5 25,15.5 25,17.1 U$10.INT
  Top 1.016: U$11.15 U$13.15
  Route3 0.203: v38,11 v32,11 32,10.5
  Route3 0.254: 32,10.5 28.62,7.12 26.68,7.12 24.39,4.84 U$11.15
  Route3 1.016: U$11.15 U$13.15
CANH  (via drill 0.35, 0.6)
  Top 0.203: U$7.CANH 75.38,66.24 76.06,66.91 76.06,71.63 74.09,73.59 71.05,73.59 70.11,72.65 51.09,72.65 50.07,73.67 50.07,77.89 49.84,78.17 47.48,78.17 U$6.P$53 | U$10.CANH 19.06,16.92 19.06,19.06 14.84,23.28 v14.23,23.28 | v31.35,73.01 30.54,73.82 24.24,73.82 19.36,68.95 16.91,68.95 U$8.CANH 20.96,68.96 v21,69
  Top 0.254: U$8.CANH 15.74,68.96 v15.3,69.4 | v10.68,70.11 10.1,69.54 R6.1
  Route3 0.203: U$6.P$53 42.4,73.01 35.42,73.01 34.61,72.2 34.61,71.42 33.76,70.58 31.22,70.58 30.75,71.05 30.75,71.72 31.35,72.32 v31.35,73.01
  Bottom 0.203: v14.23,23.28 7.38,30.13 7.38,52.69 9.81,55.13 9.81,68.59 9.84,68.61
  Bottom 0.254: 10.62,69.4 v15.3,69.4 | 9.84,68.61 10.62,69.4 | 10.62,69.4 10.62,70.06 v10.68,70.11
CANL  (via drill 0.6)
  Top 0.203: U$7.CANL 75.02,66.89 75.25,67.12 75.25,71.18 73.36,73.06 71.09,73.06 70.28,72.25 49.63,72.25 48.82,73.06 | 48.82,73.06 U$6.P$57 | U$10.CANL 18.35,16.94 18.35,18.96 15.25,22.06 13.22,22.06 12.41,22.87 v12.41,23.07 | v19.5,70.5 18.61,69.61 U$8.CANL 16.95,69.56 18.75,69.56 23.63,74.43 33.18,74.43 33.8,73.82 36.05,73.82 36.8,73.06 48.82,73.06 | v11.03,74.33 10.18,74.33 R5.1
  Route3 0.203: v19.5,70.5 17.5,70.5 13.67,74.33 v11.03,74.33
  Bottom 0.203: v12.41,23.07 6.97,28.51 6.97,52.89 9.41,55.33 9.41,69.35 9,69.76 9,74.33 v11.03,74.33
ESTIMAT_3V3  (via drill 0.35, 0.6)
  Top 0.203: U1.13 11.4,45 C5.1 C7.1 11,42.4 v11,41.4 | U1.87 21,53.5 20.6,54 C1.1 19.69,54.6 17.94,56.35 | U1.73 C6.1 C4.1 29.6,52.5 v28.5,52.5 | C8.1 24.86,35.64 24,36.5 U1.45 | U2.13 43,11.4 C37.1 C34.1 45.6,11 v46.6,11 | U2.87 34.5,21 34,20.6 C50.1 31.5,18.1 v31.5,18 | U2.73 38.06,29.42 37.79,29.69 C35.1 C38.1 35.91,29.58 v35.5,28.3 | 52.46,25 C39.1 | 52.46,25 52.36,24.86 51.5,24 U2.45 | U$8.3.3V@CAN2 28.94,65.88 v29.12,65.69 | 16.56,73.38 U$8.3.3V@CAN1 | U$10.3.3V@CAN2 22.12,28.42 v22.41,28.71 | U$10.3.3V@CAN1 13.37,16.62 v13.07,16.32 | 57.67,36.63 v57.67,50.56 57.67,58.18 57.63,58.21 | R10.1 37.45,36.84 36.33,36.84 v36.33,35.82 36.33,35.06 | 36.33,35.06 36.41,34.98 R9.1 37.51,35.06 36.33,35.06 | v50.56,35.57 57.67,35.57 57.67,36.63 | 47.53,61.16 46.89,60.52 v45.75,60.52 45.3,60.97 44.13,60.97 | U$17.CS 45.17,63.74 45.22,64.65 | v49.79,60.46 49.79,66.05 49.54,66.3 C24.1 | C23.1 55.95,57.32 | 55.95,57.32 55.95,57.73 | 55.95,57.73 55.7,57.98 v56.01,57.96 | v56.01,57.96 55.73,58.63 U$18.VDD | U$18.I2C/!SPI 58.16,60.07 58.19,60.04 58.19,58.77 57.63,58.21 | 57.63,58.21 57.5,58.09 56.65,58.09 56.31,58.09 55.95,57.73 | v53.62,61.01 54.21,61.07 U$18.VDDIO | v56.01,57.96 55.7,57.57 55.95,57.32 | C28.1 C27.1 57.67,36.63 | U$17.VDDIO 44.13,61.8 44.13,60.97 | v52.6,23.95 52.46,24.09 52.46,25 | 40.65,60.97 40.67,60.99 SDO/SA1.P$3 40.86,60.97 44.13,60.97
  Top 0.254: v45.75,60.52 45.75,61.91 U$17.VDD | C25.2 47.53,61.16 | v45.75,64.65 45.22,64.65 45.16,64.65 45.16,66.26 C24.1 | U$18.!SPI_CS 56.7,58.14 56.65,58.09 | U$8.3.3V@CAN2 30.24,68.74 30.24,72.91 v26.43,72.91 | U$8.3.3V@CAN1 16.77,73.52 16.77,74.43 v22.11,74.43 | v18,56.5 17.94,56.44 17.94,56.35 | C8.1 24.95,35.4 v23.95,35.4
  Top 0.305: U4.P$5 8.19,75.7 11.22,75.7 13.51,73.42 16.58,73.42 U$8.3.3V@CAN1
  Top 0.61: U4.P$5 C32.1 C44.2
  Route3 0.203: v53.62,61.01 53.64,58.29 53.69,58.24 55.65,58.26 v56.01,57.96
  Route3 0.254: v22.11,74.43 23.63,72.91 v26.43,72.91
  Bottom 0.203: v29.12,65.69 29.12,65.49 28.91,65.29 | v22.41,28.71 22.62,28.71 22.82,28.91 | v13.07,16.32 12.46,16.32 | v36.33,35.82 36.59,36.08 44.71,36.08 44.97,35.82 44.97,35.57 | 44.97,35.57 44.97,30.49 | v50.56,35.57 44.97,35.57 | 49.79,59.19 49.79,50.56 v57.67,50.56 | 45.73,60.46 45.73,59.19 49.79,59.19 | 49.79,59.19 v49.79,60.46
  Bottom 0.254: v45.75,60.52 v45.75,64.65
  pour Bottom: -0.24,91.23 62.75,91.19 62.5,75 31.16,75 31,31 63,31 63,-0.5 -2.25,-0.75
ESTIMAT_5V  (via drill 0.35, 0.6)
  Top 0.203: v25,72 25.65,72 U$8.5V | U$10.5V 14.85,26.15 14,27 14,29 15.25,30.25 v28.75,30.25
  Top 0.406: C51.2 3.89,74.18 v2.55,74.18 v2.55,74.94
  Top 0.61: U6.P$5 C48.1 C51.2
  Route3 0.406: v25,72 24.62,72.38 23.06,72.38 19.94,75.49 6.7,75.49 6.15,74.94 v2.55,74.94 v2.55,74.18
  Bottom 0.203: v25,72 26,72 28,70 31.25,70 31.25,32.75 v28.75,30.25
ESTIMAT_DRDY  (via drill 0.35)
  Top 0.203: U$18.DRDY 54.64,60.03 54.14,60.03 v51.04,56.93
  Top 0.254: J2.14 v52.59,55.38
  Bottom 0.254: v52.59,55.38 v51.04,56.93
ESTIMAT_DRDY_JP
  Top 0.254: J2.13 45.48,37.09 45.48,30.49 44,29.01 U2.61
ESTIMAT_GND  (via drill 0.35, 0.51, 0.6)
  Top 0.152: C26.2 52.89,64.32 52.84,64.27 v52.84,64.02
  Top 0.203: C11.2 v25.5,58.5 | C9.2 v26.5,31.5 | C10.2 v18,31.5 | C3.2 v8.2,46.5 | C5.2 v8.2,44.5 | C7.2 v8.2,42.5 | U1.15 14.25,44 14.25,45 v14.75,45 | C1.2 v20,57.5 | U1.82 23.5,51 | 23.5,51 | 23.5,51 v24,51 | U1.84 22.5,51 v22,51 | U1.72 v26.5,49.5 | C6.2 v30.34,47.41 | C4.2 v30.2,55.13 | U1.40 v21.5,39 | U1.43 v23,39 | C8.2 27.76,35.44 v28,35.5 | C12.2 26,57 v26.5,57.5 | C42.2 v29.5,25.5 | C40.2 v56.5,26.5 | C41.2 v56.5,18 | C33.2 v41.5,8.2 | C37.2 v43.5,8.2 | C34.2 v45.5,8.2 | U2.15 43.95,14.08 43.59,14.44 v43.59,14.5 | C50.2 v30.5,20 | U2.82 37,23.5 | 37,23.5 | 37,23.5 v37,24 | U2.84 37,22.5 v37,22 | U2.72 v38.5,26.5 | C35.2 v40.56,30 | C38.2 v33.48,29.79 | U2.40 v49,21.5 | U2.43 v49,23 | C39.2 52.56,27.76 v52.5,28 | C43.2 31,26 v30.5,26.5 | R1.2 v12.25,31.56 | R2.2 57.76,12.86 v57.77,13.07 | C16.2 10,72.15 v10.83,72.15 | U$18.GND 55.7,62.57 v55.38,62.84 | C23.2 55.89,55.35 v55.89,54.37 | C27.2 59.7,36.74 59.7,36.33 59.66,36.37 C27.2 | C27.2 C28.2 | C27.2 59.7,36.81 v59.7,37.86
  Top 0.254: U$17.SDX U$17.SCX 44.5,62.5 | 44.5,62.5 44.66,62.34 U$17.GND@1 U$17.GND@2 | 44.5,62.5 v44.55,62.55 | v42.34,66.01 43.01,66.01 C24.2 42.95,66.65 v42.34,66.65 | v47.38,64.12 47.38,63.5 47.57,63.3 | 47.57,63.3 C25.1 | v48.02,64.12 48.02,63.75 47.57,63.3 | v40.36,65.67 40.67,65.33 40.67,65.3 | v40.99,65.67 40.67,65.3 | 40.67,65.3 SDO/SA1.P$1
  Top 0.305: v3.4,79.35 3.28,78.59 3.22,78.53 | 3.22,78.53 C44.1 | v2.77,79.35 3.22,78.77 3.22,78.53 | v10.71,82.84 10.58,82.08 C36.1 9.94,82.28 v10.07,82.84
  Top 0.508: v10.07,82.84 10.37,83.14 C2.2 10.37,83.17 v10.71,82.84
  Top 0.61: U4.P$2 v11.31,77.42 v11.31,78.05 | U6.P$2 v4.9,66.18 v5.53,66.18 | v6.78,73.83 6.49,74.11 C51.1 6.43,74.11 v6.78,74.46 | v1.56,69.89 1.56,69.19 C49.1 1.85,69.54 v2.2,69.89
  GND 0.203: v10.83,72.15 11.24,71.74 | v55.89,54.37 55.64,54.11 55.64,53.6 | v59.7,37.86 59.95,38.11 60.72,38.11
  Bottom 0.203: v8.2,42.5 7.91,42.5 | v14.75,45 14.89,44.75 | v20,57.5 20,58 | v24,51 24.09,51 | v22,51 21.7,51 | v26.5,49.5 26.41,49.5 | v30.34,47.41 30.79,48.05 | v30.2,55.13 30.5,54.72 | v21.5,39 21.5,39.5 | v23,39 23,39.5 23.5,39 | v28,35.5 28.25,35.5 | v26.5,57.5 27,57.5 | v45.5,8.2 45.5,7.5 | v43.59,14.5 43.75,14.49 | v30.5,20 30,20 | v37,24 37,24.09 | v37,22 37,21.7 | v38.5,26.5 38.5,26.41 | v40.56,30 40.77,30.18 | v33.48,29.79 33.16,29.75 | v49,21.5 48.5,21.5 | v49,23 48.5,23 49,23.5 | v52.5,28 53,28 | v30.5,26.5 30.7,26.19 | v12.25,31.56 12.66,31.56 | v57.77,13.07 57.77,13.47 | v55.38,62.84 54.95,63.32
  Bottom 0.254: v44.55,62.55 44.5,62.5
  pour GND: -0.71,92.66 62.3,92.56 62.5,71 34.16,71 34,33 63,33 63,-0.5 -2.25,-0.75
  pour GND: 43,33 43,34 36,34 36,69 62,69 61.99,62.14 54.11,62.24 54.11,58.43 61.99,58.43 62,34 47,34 47,33
  pour GND (no thermals): 61.99,58.18 61.99,62.24 57.92,62.24 57.92,58.18
ESTIMAT_LDO_3V3_BYP
  Top 0.61: U4.P$4 C32.2
ESTIMAT_LDO_5V_BYP
  Top 0.61: U6.P$4 C48.2
ESTIMAT_SCL_IMU  (via drill 0.35)
  Top 0.254: U$17.SCL 44.66,64.16 44.03,64.79 42.7,64.79 42.19,64.28 39.65,64.28 38.36,63 38.36,53.6 42.43,49.54 J2.6 43.7,45.48 45.49,45.48 46.24,44.73 v46.24,39.63 | v59.7,9.41 59.7,27.19 v56.91,29.98
  Top 1.016: U$11.5 U$13.5
  Route3 0.254: U$11.5 54.11,9.41 v59.7,9.41 | v56.91,29.98 56.4,30.49 46.49,30.49 46.49,39.38 v46.24,39.63
  Route3 1.016: U$13.5 U$11.5
ESTIMAT_SCL_JP  (via drill 0.35)
  Top 0.254: J2.1 39.39,42.16 39.39,37.09 R10.2 39.39,36.45 38.66,35.72 38.66,34.25 38.86,34.05 43.44,34.05 43.44,31 v44.21,30.24 | U2.79 41.76,25 v43.19,26.43
  Route3 0.254: v43.19,26.43 44.21,27.44 v44.21,30.24
  Bottom 0.254: J2.1 38.09,44.21 39.36,45.48 40.41,45.48 41.68,44.21 J2.5
ESTIMAT_SCL_MAG  (via drill 0.35)
  Top 0.203: U$18.SCL/SPI_SCK 52.62,56.46
  Top 0.254: 52.62,56.46 48.66,52.5 v48.61,52.5
  Bottom 0.254: v48.61,52.5 46.44,52.5 46.09,52.85 43.45,52.85 J2.2
ESTIMAT_SDA_IMU
  Top 0.254: U$17.SDA 44.16,64.02 43.84,64.34 42.89,64.34 42.3,63.75 39.76,63.75 39.03,63.01 39.03,54.46 44.97,48.52 J2.8
ESTIMAT_SDA_JP  (via drill 0.35)
  Top 0.254: J2.7 44.22,44.21 42.95,45.48 41.9,45.48 40.63,44.21 J2.3 40.65,43.44 40.65,35.32 | R9.2 39.47,35.06 40.4,35.06 40.65,35.32 | U2.78 41.25,25.5 v42.17,26.43 | v44.21,31.51 44.21,34.55 43.44,35.32 40.65,35.32
  Route3 0.254: v44.21,31.51 44.21,31.24 43.5,30.53 43.5,27.75 v42.17,26.43
ESTIMAT_SDA_MAG  (via drill 0.35)
  Top 0.203: U$18.SDA/SPI_SDI 50.08,54.97
  Top 0.254: 50.08,54.97 47.25,52.14 v45.79,52.14 | v58.68,8.65 58.68,9.65 58.69,9.66 58.69,25.48 52.42,31.76 v47.25,31.76
  Top 1.016: U$11.4 U$13.4
  Route3 0.254: v58.68,8.65 56.03,8.65 U$11.4
  Route3 1.016: U$11.4 U$13.4
  Bottom 0.254: v45.79,52.14 40.4,46.75 J2.4 41.16,45.48 42.95,45.48 43.7,44.73 43.7,42.94 43.95,42.68 43.95,37.45 50.15,37.45 51.39,36.21 51.39,34.93 51.2,34.74 46.93,34.74 46.49,34.3 46.49,32.52 v47.25,31.76
ESTIMAT_SOC  (via drill 0.35, 0.6)
  Top 0.203: U$18.SOC 56.7,62.34 v57.05,62.86
  Top 0.254: J2.16 55.13,53.6 v53.86,54.87
  Bottom 0.203: v57.05,62.86 57.1,63.24 57.25,63.39
  Bottom 0.254: v53.86,54.87 55.64,56.65 58.68,56.65 59.19,57.16 59.19,63.51 59.08,63.39 57.25,63.39
ESTIMAT_SOC_JP
  Top 0.254: J2.15 46,35.08 U2.57
ESTIMAT_VBAT
  Top 0.254: U4.P$3 | 10.12,79.72 C36.2 11.38,79.96 11.44,80.02 11.44,80.78 | U6.P$1 | 11.44,80.78 11.44,81.07 11.45,81.09 11.45,84.64 C2.1 | U$6.P$78 60.24,80.69 11.53,80.69 11.44,80.78
  Top 0.508: U4.P$1 | C49.2 1.85,67.32 | 1.66,67.19 C49.2 | 8.77,78.37 8.77,79.89 8.39,80.27 1.79,80.27 1.53,80.02 1.53,71.38 2.55,71.38 2.8,71.13 2.8,70.72 3.06,70.47 3.06,68.84 3.19,68.72 3.95,68.72 | U6.P$1 3.9,67.32 2.42,67.32 C49.2
  Top 0.61: U4.P$3 8.77,78.37 8.77,76.46 U4.P$1 | 10.12,79.72 U4.P$3 | U6.P$1 3.95,68.72 5.85,68.72 U6.P$3
  Top 1.524: U$6.P$78 U$6.P$77
I2C_SCL1  (via drill 0.6)
  Top 0.203: v24.57,49.56 24.77,49.96 24.66,49.96 24.7,49.69 25,50.3 U1.79
  Top 1.016: U$12.5 U$3.5
  Route3 0.203: U$3.5 9.66,26.43 20,36.76 20,37.25 20,37.35 20,45.4 24.16,49.56 v24.57,49.56
  Route3 1.016: U$3.5 U$12.5
I2C_SDA1  (via drill 0.6)
  Top 0.203: 24.65,47.61 v24.56,47.52 | 24.65,47.61 25.5,48.46 U1.78 | 24.65,47.61 24.65,47.41
  Top 1.016: U$12.4 U$3.4
  Route3 0.203: U$3.4 7.87,23.89 20.5,36.52 20.5,45.25 22.77,47.52 v24.56,47.52
  Route3 1.016: U$3.4 U$12.4
IMU_INT1
  Top 0.203: U$17.INT1 39.89,61.99 39.63,61.73
  Top 0.254: 39.63,61.73 39.63,56.65 47.51,48.78 J2.10
IMU_INT2
  Top 0.203: 48.05,59.82 46.86,59.82 44.97,57.92
  Top 0.254: U$17.INT2 45.87,62.53 46.2,62.53 46.59,62.93 46.59,64.55 46.87,64.83 48.53,64.83 48.75,64.61 48.75,60.52 48.05,59.82 | 44.97,57.92 44.97,51.97 47.97,48.97 47.97,48.83 J2.12
N$1
  Top 0.203: U2.16 44.5,14.02 45.17,14.69 48.83,14.69 51.06,12.46 51.06,12.24 D2.A
N$2
  Top 0.203: D2.C 56.89,11.07 R2.1
N$3
  Top 0.203: U1.16 14.13,43.5 14.49,43.14 14.49,39.08 13.27,37.86 11.36,37.86 D1.A
N$4
  Top 0.203: R1.1 9.52,33.02 D1.C
N$7
  Top 0.203: U1.12 11.9,45.5 C3.1
N$8
  Top 0.203: 21,34 22,35 U1.41 | U1.41 | U$1.P$2 20,33.5 19.1,33.5 C10.1
  Top 0.254: 20,33.5 20.5,34 21,34
N$9
  Top 0.203: U1.42 22.5,35 23.5,34 U$1.P$1 24.5,33.5 25.4,33.5 C9.1
N$10
  Top 0.203: U1.85 21.93,53.56 21.93,55.47 24.25,55.45 U$2.P$3 24.4,54.3 C12.1
N$11
  Top 0.203: U1.86 21.49,52.78 21.49,55.81 22.63,56.55 U$2.P$1 22.75,58.35 C11.1
N$16
  Top 0.508: D4.C R4.1
N$17
  Top 0.203: R6.2 8.06,68.55 C16.1 8.08,72.03 R5.2
N$18
  Top 0.508: D3.C R8.1
N$19
  Top 0.203: U$15.C1 73.97,12.02 73.97,13.83 73.45,14.52 C17.1
N$20
  Top 0.203: U$15.SETP 76.34,12.79 C18.2
N$21
  Top 0.203: U$15.SETC 72.25,12.74 72.25,13.52 72.25,13.47 72.36,13.59 72.38,13.59 72.55,13.76 72.55,15.55 72.65,15.66 75.8,15.66 76.54,14.92 C18.1
N$25
  Top 0.254: SDO/SA1.P$2 42.57,63.06 43,63.49 U$17.SDO/SA0
N$34
  Top 0.203: U$18.C1 56.2,64.32 C26.1
N$35
  Top 0.203: U$18.SETP 57.59,61.07 58.55,62.02 58.55,62.7 C22.2
N$36
  Top 0.203: U$18.SETC 55.2,61.68 54.43,62.45 54.43,63.09 54.94,63.6 54.94,65.4 54.99,65.45 58.04,65.45 58.72,64.77 58.72,64.73 C22.1
N$40
  Top 0.203: U2.42 53,22.5 54,23.5 U$4.P$1 54.5,24.5 54.5,25.4 C40.1
N$41
  Top 0.203: U2.41 53,22 54,21 U$4.P$2 54.5,20 54.5,19.1 C41.1 | U2.41
N$42
  Top 0.203: U2.86 35.22,21.49 32.19,21.49 31.45,22.63 U$9.P$1 29.65,22.75 C42.1
N$43
  Top 0.203: U2.85 35.09,21.98 32.53,21.98 32.55,24.25 U$9.P$3 33.7,24.4 C43.1
RST1  (via drill 0.35)
  Top 0.203: 23.02,52.59 23.02,52.76 | 23.02,52.59 23.02,50.52 22.18,49.93 20.92,49.93 19.95,50.9 14.66,50.9 13.65,51.92 10.23,51.92 9.62,51.31 9.62,49.48 9.17,49.03 v9.15,49.03 | U1.83 23.01,52.59 23.02,52.59
  Top 1.016: U$12.9 U$3.9
  Route3 0.203: v9.15,49.03 9.15,39.13 6.61,36.59 U$3.9
  Route3 1.016: U$3.9 U$12.9
RST2
  Top 0.254: U2.83 37.47,23 37.86,22.62 37.86,20.84 36.84,19.82 36.84,14.23 36.08,13.47 36.08,8.14 U$11.9
  Top 1.016: U$11.9 U$13.9
  Route3 1.016: U$11.9 U$13.9
SBWTCK
  Top 0.203: U$7.SBWTCK 77.8,37.54 78.29,37.04 83.35,37.04 U$14.SBWTCK
SBWTDIO
  Top 0.203: U$7.SBWTDIO 78.3,37.65 78.5,37.45 83.52,37.45 85.56,35.4 U$14.2
SPI-CLK1  (via drill 0.6)
  Top 0.203: v16.13,49.76 16.13,48.13 14.99,47 U1.9 | v14.71,57.69 17.25,60.26 U$8.CLK
  Top 1.016: U$3.17 U$12.17
  Route3 0.203: v16.13,49.76 16.13,56.87 v14.71,57.69 14.1,58.29 8,58.29 6.61,56.91 U$3.17
  Route3 1.016: U$3.17 U$12.17
SPI-CLK2  (via drill 0.6)
  Top 0.203: U2.9 41,14.99 39.87,16.13 v38.24,16.13 | v30.32,14.71 27.74,17.25 U$10.CLK
  Top 1.016: U$11.17 U$13.17
  Route3 0.203: v38.24,16.13 31.13,16.13 v30.32,14.71
  Route3 0.254: U$11.17 20.05,4.84 23.26,8.04 27.1,8.04 29.71,10.64 29.71,14.1 v30.32,14.71
  Route3 1.016: U$11.17 U$13.17
SPI-CS1  (via drill 0.6)
  Top 0.203: v14.71,49.76 14.71,47.52 14.68,47.5 U1.8 | v14.71,55.86 22.63,63.78 23.88,63.78
  Top 0.254: 23.88,63.78 U$8.CS 23.88,63.78
  Top 1.016: U$3.16 U$12.16
  Route3 0.203: v14.71,49.76 v14.71,55.86 13.28,55.86 11.46,57.69 8.41,57.69 U$3.16
  Route3 1.016: U$3.16 U$12.16
SPI-CS2  (via drill 0.6)
  Top 0.203: U2.8 40.5,14.68 40.48,14.71 v38.24,14.71 | v31.89,14.96 24.22,22.63 24.22,23.88 U$10.CS
  Top 1.016: U$11.16 U$13.16
  Route3 0.203: v31.89,14.96 v38.24,14.71
  Route3 0.254: U$11.16 22.59,4.84 25.34,7.58 27.66,7.58 30.74,10.67 30.74,13.22 31.89,14.36 v31.89,14.96
  Route3 1.016: U$11.16 U$13.16
SPI-MISO1  (via drill 0.6)
  Top 0.203: v19.18,49.76 19.18,48.74 16.43,46 U1.11 | v20.8,59.51 20.86,59.51 U$8.MISO
  Top 1.016: U$3.19 U$12.19
  Route3 0.203: v19.18,49.76 19.18,58.5 20.19,59.51 v20.8,59.51 20.4,59.92 8.93,59.92 6.87,61.99 U$3.19
  Route3 1.016: U$3.19 U$12.19
SPI-MISO2  (via drill 0.6)
  Top 0.203: U2.11 42,16.43 39.26,19.18 v38.24,19.18 | v28.49,20.8 28.49,20.86 U$10.MISO
  Top 1.016: U$11.19 U$13.19
  Route3 0.203: v38.24,19.18 29.5,19.18 28.49,20.19 v28.49,20.8
  Route3 0.254: U$11.19 14.98,4.84 19.09,8.95 25.84,8.95 28.02,11.12 28.02,17.69 29.5,19.18
  Route3 1.016: U$11.19 U$13.19
SPI-MOSI1  (via drill 0.6)
  Top 0.203: v17.75,49.76 17.75,48.74 15.51,46.5 U1.10 | v18.36,57.89 18.36,58.6 22.84,63.17 23.73,63.17 U$8.MOSI
  Top 1.016: U$3.18 U$12.18
  Route3 0.203: v17.75,49.76 17.75,50.57 16.94,51.39 16.94,57.28 17.15,57.48 | 17.15,57.48 17.75,57.48 | 17.75,57.48 v18.36,57.89 17.96,57.48 17.75,57.48 | 17.15,57.48 15.72,58.9 7.66,58.9 7.12,59.45 U$3.18
  Route3 1.016: U$3.18 U$12.18
SPI-MOSI2  (via drill 0.6)
  Top 0.203: U2.10 41.5,15.51 39.26,17.75 v38.24,17.75 | v30.11,18.36 29.4,18.36 24.83,22.84 24.83,23.73 U$10.MOSI
  Top 1.016: U$11.18 U$13.18
  Route3 0.203: v38.24,17.75 37.43,17.75 36.61,16.94 30.72,16.94 30.52,17.15 30.52,17.75 | 30.52,17.75 v30.11,18.36 30.52,17.96 30.52,17.75
  Route3 0.254: U$11.18 17.52,4.84 21.17,8.49 26.74,8.49 29.1,10.85 29.1,16.14 30.1,17.15 30.52,17.15
  Route3 1.016: U$11.18 U$13.18
SYNC1  (via drill 0.6)
  Top 0.203: U$7.P7.2_SYNC1 73.31,38.69 73.31,45.07 74.53,46.29 v74.53,46.8 | U2.64 42.5,30.98 41.78,31.7 35.89,31.7 31.35,31.73 31.35,45.07 31.96,45.07 | 31.96,45.07 31.96,70.16 33.18,70.16 v33.18,72.81 | U1.64 29.2,45.5 v29.93,44.77 | v32.37,44.77 32.37,45.17 31.96,45.07
  Route3 0.203: v29.93,44.77 v32.37,44.77 | v33.18,72.81 33.18,75.35 40.17,75.33 41.19,76.34 U$6.P$45
  Bottom 0.203: v74.53,46.8 75.65,47.91 75.65,54.11 73.21,56.55 73.21,73.47 46.59,73.47 44.99,75.07 44.99,77.68 44.56,78.14 42.53,78.14 41.32,76.88 U$6.P$45
SYNC2  (via drill 0.6)
  Top 0.203: U$7.PJ.3_SYNC2 v72.81,46.8 | U2.65 42,30.87 41.58,31.29 33.68,31.29 30.95,31.28 30.95,45.98 | 30.95,45.98 28.09,45.98 U1.65 | 30.95,45.98 31.56,45.98 v31.56,71.38
  Route3 0.203: v31.56,71.38 31.76,71.59 34.2,71.59 34.2,74.84 42.73,74.84 43.73,75.84 U$6.P$49
  Bottom 0.203: v72.81,46.8 75.25,49.23 75.25,53.91 72.81,56.35 72.81,73.06 46.39,73.06 43.73,75.72 U$6.P$49 43.73,76.48
TCK_SWDCLK1
  Top 0.203: 7.63,53.75 | U1.95 17,53.44 16.7,53.75 10.98,53.75 10.77,53.53 9.87,53.53 9.65,53.75 7.63,53.75 | 7.63,53.75 7.17,53.29 7.17,47.17 6.77,46.77 6.77,41.58 5.09,39.91 U$3.10
  Top 1.016: U$12.10 U$3.10
  Route3 1.016: U$12.10 U$3.10
TCK_SWDCLK2
  Top 0.254: U2.95 34.53,17 34.3,16.77 34.3,7.38 U$11.10
  Top 1.016: U$11.10 U$13.10
  Route3 1.016: U$11.10 U$13.10
TDI1
  Top 0.203: U1.92 18.5,53.77 17.47,54.8 17.31,54.97 17.25,55.03 10.88,55.03 10.6,55.3 10.03,55.3 9.62,54.89 7.36,54.89 6.36,53.89 6.36,47.51 5.6,46.75 U$3.13
  Top 1.016: U$3.13 U$12.13
  Route3 1.016: U$12.13 U$3.13
TDI2
  Top 0.254: U2.92 35.41,18.48 34.07,18.48 32.93,17.34 32.93,8.54 U$11.13
  Top 1.016: U$11.13 U$13.13
  Route3 1.016: U$11.13 U$13.13
TDO1  (via drill 0.35)
  Top 0.203: U1.93 18,53.66 17.04,54.62 v10.32,54.62
  Top 1.016: U$3.12 U$12.12
  Route3 0.203: U$3.12 5.09,44.71 7.63,47.25 7.63,52.33 9.92,54.62 v10.32,54.62
  Route3 1.016: U$12.12 U$3.12
TDO2
  Top 0.254: U2.93 35.41,17.98 34.21,17.98 33.39,17.15 33.39,6.46 U$11.12
  Top 1.016: U$11.12 U$13.12
  Route3 1.016: U$11.12 U$13.12
TMS_SWDIO1
  Top 0.203: U$3.11 6.36,42.94 6.36,46.93 6.77,47.34 6.77,53.49 7.43,54.15 9.82,54.15 10.03,53.94 10.6,53.94 10.88,54.21 16.87,54.21 17.5,53.59 U1.94
  Top 1.016: U$12.11 U$3.11
  Route3 1.016: U$12.11 U$3.11
TMS_SWDIO2
  Top 0.254: U2.94 35.41,17.48 34.36,17.48 33.84,16.96 33.84,7.19 34.3,6.73 U$11.11
  Top 1.016: U$11.11 U$13.11
  Route3 1.016: U$11.11 U$13.11
UART_RXD1
  Top 0.254: U1.34 18.5,35.77 18.3,35.57 17.28,35.57 17.28,33.79 12.46,28.97 12.46,25.66 10.42,23.63 10.42,19.82 9.41,18.81 U$3.2
  Top 1.016: U$12.2 U$3.2
  Route3 1.016: U$12.2 U$3.2
UART_RXD2
  Top 0.203: U2.34 52.13,18.5 53.5,17.13 53.5,8.39 55.74,6.16 56.3,6.16 U$11.2
  Top 1.016: U$11.2 U$13.2
  Route3 1.016: U$11.2 U$13.2
UART_TXD1
  Top 0.254: U1.35 19,35.26 18.81,35.06 17.79,35.06 17.79,33.54 12.96,28.71 12.96,25.41 10.93,23.38 10.93,19.57 7.63,16.27 U$3.1
  Top 1.016: U$12.1 U$3.1
  Route3 1.016: U$12.1 U$3.1
UART_TXD2
  Top 0.203: U2.35 52.24,19 53.91,17.33 53.91,8.59 55.94,6.56 58.44,6.56 U$11.1
  Top 1.016: U$11.1 U$13.1
  Route3 1.016: U$11.1 U$13.1
VCORE
  Top 0.203: U2.12 42.5,11.9 C33.1

## Text on the board
Reference: COMPUTER GND | BDOT GND | COMPUTER VBAT | BDOT VBAT | SYNC1 | SYNC2 | CANL | CANH | MSP432 (MPC) | COMPUTER GND | SPI MISO | SPI MOSI | SPI CLK | SPI CS | CAN-INT | P3.5 GPIO | COMPUTER GND | P3.4 GPIO | TDI | BDOT GND | TDO | BDOT GND | TMS SWDIO | RXD | TCK SWDCLK | TXD | RST | SBWTDIO | BCLUART RXD | SBWTCK | BCLUART TXD | COMPUTER GND | I2C SCL | I2C SDA | COMPUTER GND | UART RXD | UART TXD | COMPUTER GND | SPI MISO | SPI MOSI | SPI CLK | SPI CS | CAN INT | COMPUTER GND | TDI | TDO | TMS SWDIO | TCK SWDCL | RST | BCLUART RXD | BCLUART TXD | COMPUTER GND | SCL (SENSOR) | SDA (SENSOR) | COMPUTER GND | UART RXD | UART TXD | MSP432 (MAIN)
tDocu: LSM6DSM
tSilk: MAG_SCL | MAG_SDA | IMU_SCL | IMU_SDA | IMU_INT1 | IMU_INT2 | MAG_DRDY | MAG_SoC | IMU | mag. | DRDY | SCL | SDA